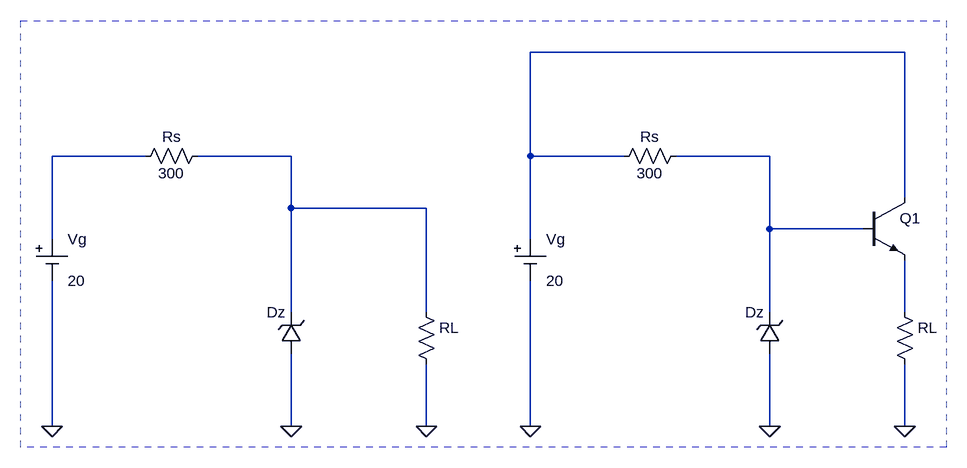
[diagram p0: schematic Ej 2.1.asc]
Ej 2.1.asc, the LTspice schematic file:
Version 4
SHEET 1 7772 18116
WIRE 1472 384 896 384
WIRE 304 544 160 544
WIRE 528 544 384 544
WIRE 896 544 896 384
WIRE 1040 544 896 544
WIRE 1264 544 1120 544
WIRE 1472 608 1472 384
WIRE 528 624 528 544
WIRE 736 624 528 624
WIRE 1264 656 1264 544
WIRE 1408 656 1264 656
WIRE 160 672 160 544
WIRE 896 672 896 544
WIRE 528 784 528 624
WIRE 736 784 736 624
WIRE 1264 784 1264 656
WIRE 1472 784 1472 704
WIRE 160 960 160 736
WIRE 528 960 528 848
WIRE 736 960 736 864
WIRE 896 960 896 736
WIRE 1264 960 1264 848
WIRE 1472 960 1472 864
FLAG 1264 960 0
FLAG 896 960 0
FLAG 1472 960 0
FLAG 528 960 0
FLAG 160 960 0
FLAG 736 960 0
SYMBOL zener 1280 848 R180
WINDOW 0 24 64 Left 2
WINDOW 3 24 0 Invisible 2
SYMATTR InstName Dz
SYMBOL npn 1408 608 R0
WINDOW 3 56 68 Invisible 2
SYMATTR InstName Q1
SYMBOL res 1136 528 R90
WINDOW 0 2 56 VBottom 2
WINDOW 3 27 56 VTop 2
SYMATTR InstName Rs
SYMATTR Value 300
SYMBOL res 1456 768 R0
WINDOW 3 36 76 Invisible 2
SYMATTR InstName RL
SYMBOL zener 544 848 R180
WINDOW 0 24 64 Left 2
WINDOW 3 24 0 Invisible 2
SYMATTR InstName Dz
SYMBOL res 400 528 R90
WINDOW 0 2 56 VBottom 2
WINDOW 3 27 56 VTop 2
SYMATTR InstName Rs
SYMATTR Value 300
SYMBOL res 720 768 R0
WINDOW 3 36 76 Invisible 2
SYMATTR InstName RL
SYMBOL Misc\\cell 160 672 R0
WINDOW 123 0 0 Left 0
WINDOW 39 0 0 Left 0
SYMATTR InstName Vg
SYMATTR Value 20
SYMBOL Misc\\cell 896 672 R0
WINDOW 123 0 0 Left 0
WINDOW 39 0 0 Left 0
SYMATTR InstName Vg
SYMATTR Value 20
RECTANGLE Normal 1536 992 112 336 2

The netlist it stands for:
* Ej 2.1.asc
Dz 0 N004 D
Q1 N001 N004 N005 0 NPN
Rs N004 N001 300
RL N005 0 R
Dz 0 N003 D
Rs N003 N002 300
RL N003 0 R
Vg N002 0 20
Vg N001 0 20
.model D D
.lib standard.dio
.model NPN NPN
.model PNP PNP
.lib standard.bjt
.backanno
.end